# EasyEDA schematic Sheet.json
TITLE: Mini Mini Robotlar; REV: 1.0; Date: 2023-05-15; Sheet: 1/1; Drawn By: Emir Bahadir Unsal; Company: Xor ve Otesi
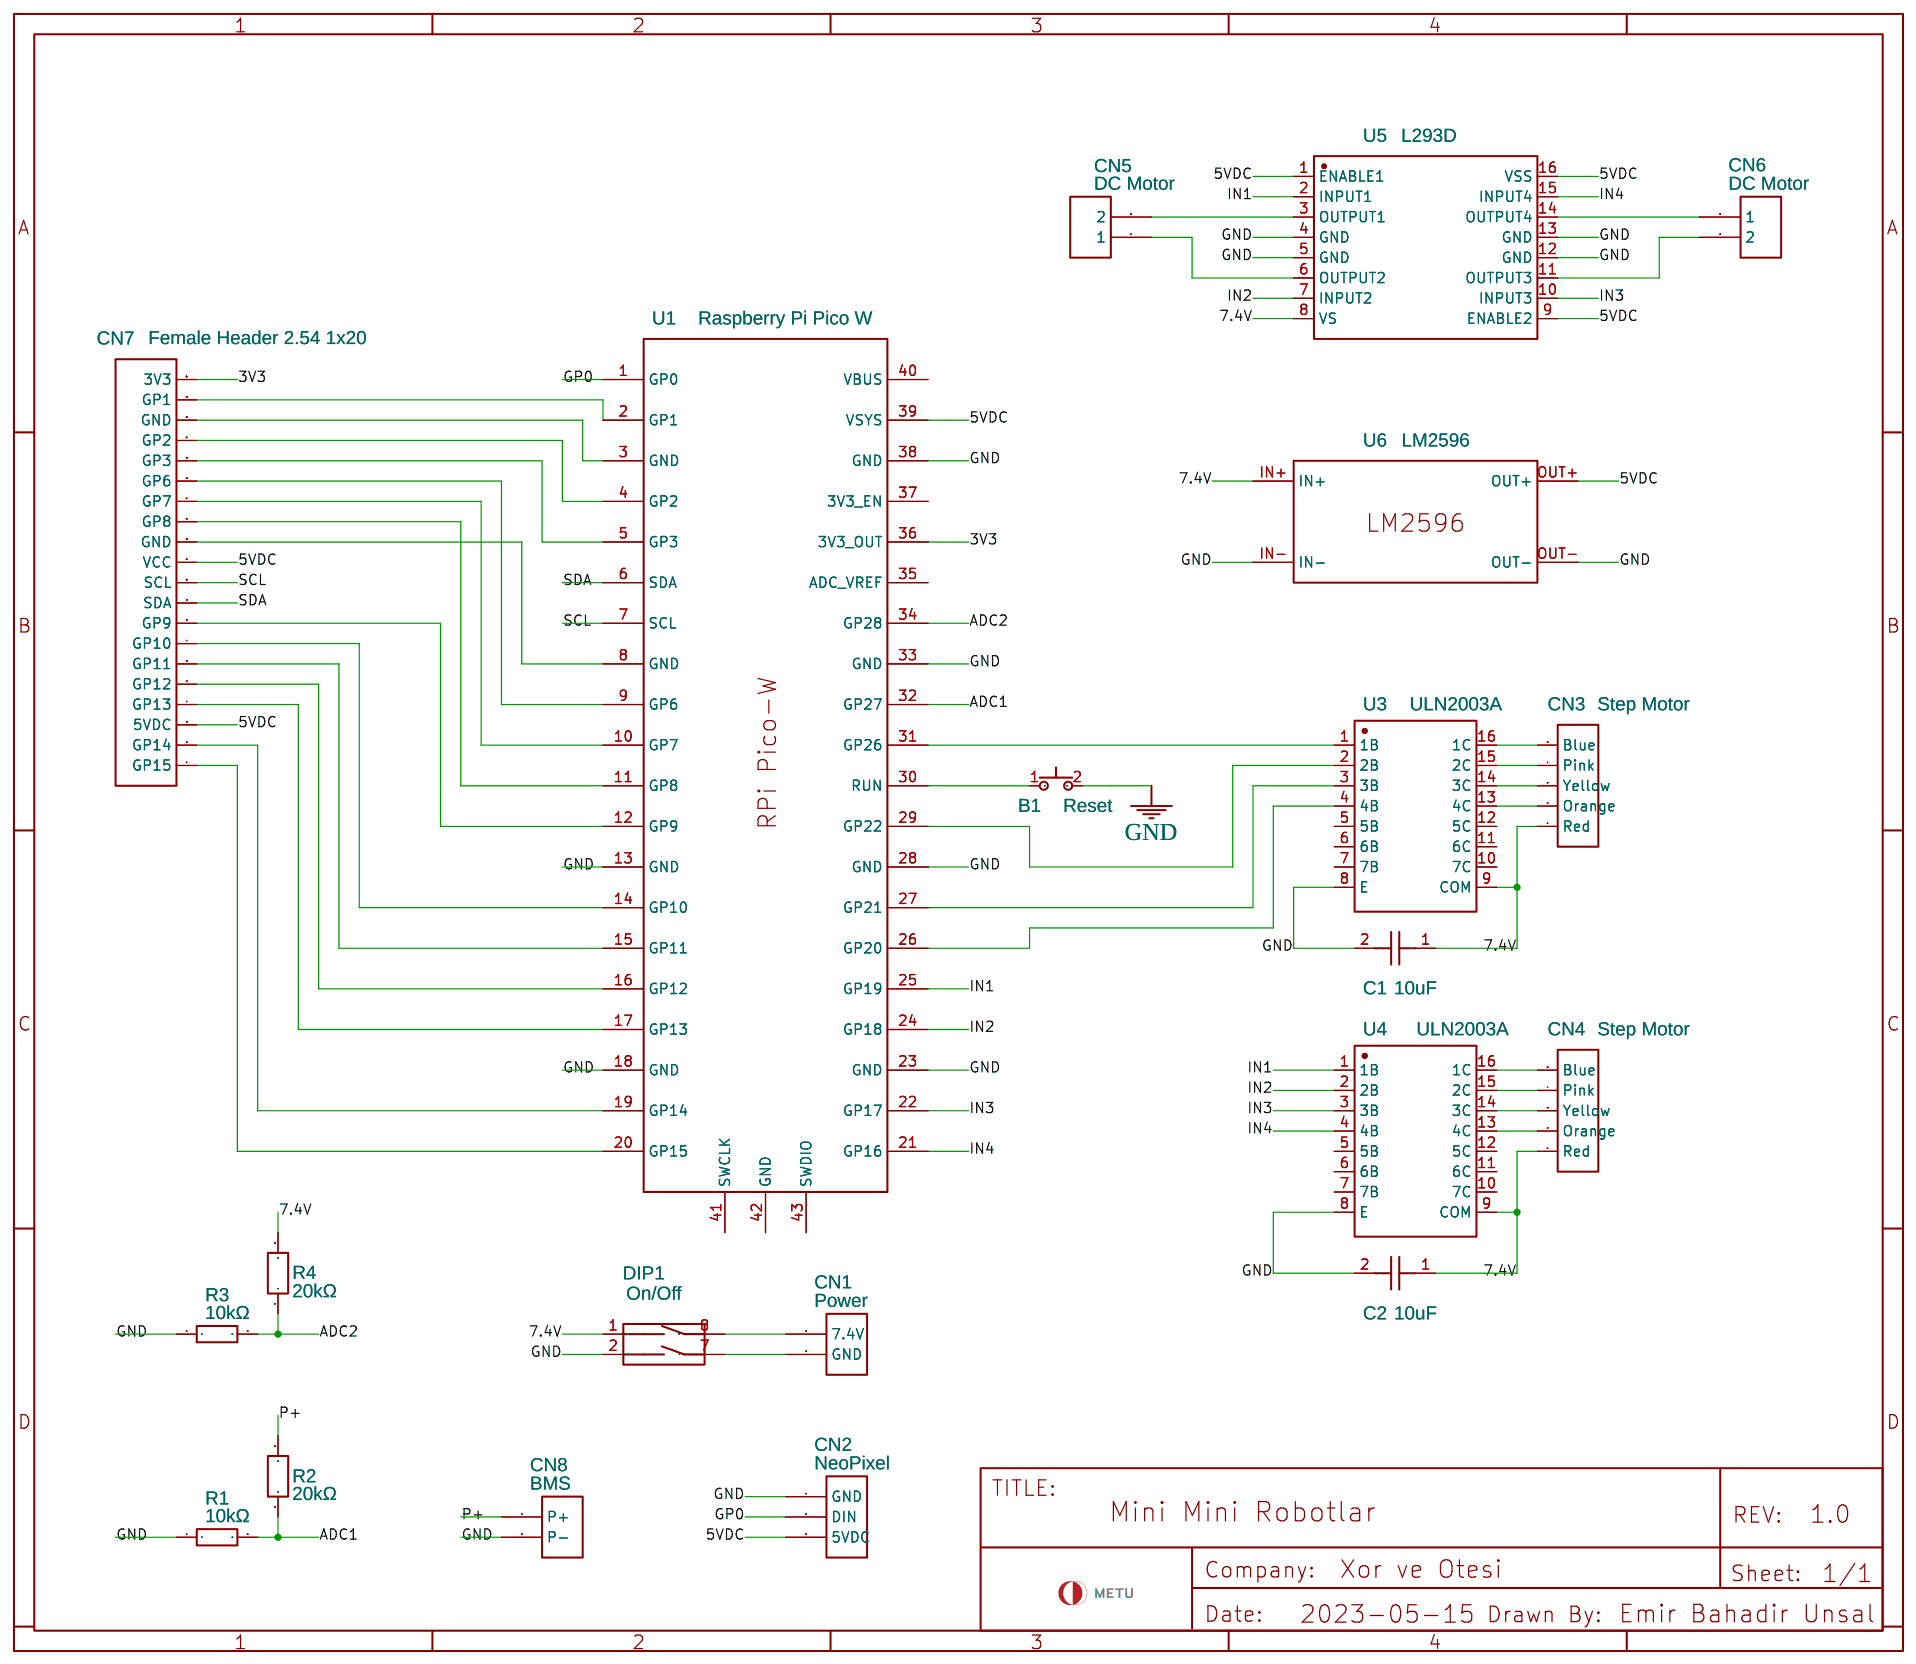
[diagram p0: schematic sheet]

## Parts
B1  Reset  [BUTTON 2PIN]
C1  10uF  [10UF_16V]
C2  10uF  [10UF_16V]
CN1  Power  [JST-XH_2P-2.54MM]
CN2  NeoPixel  [JST-XH_3_JD]
CN3  Step Motor  [JST 2.54MM 5PIN]
CN4  Step Motor  [JST 2.54MM 5PIN]
CN5  DC Motor  [JST-XH_2P-2.54MM]
CN6  DC Motor  [JST-XH_2P-2.54MM]
CN7  Female Header 2.54 1x20  [HDR-TH_20P-P2.54-V-F]
CN8  BMS  [JST-XH_2P-2.54MM]
DIP1  On/Off  [DIP SWITCH 2 SWITCHES]
R1  10kΩ  [RES-TH_BD2.3-L6.5-P10.50-D0.5]
R2  20kΩ  [RES-TH_BD2.3-L6.5-P10.50-D0.5]
R3  10kΩ  [RES-TH_BD2.3-L6.5-P10.50-D0.5]
R4  20kΩ  [RES-TH_BD2.3-L6.5-P10.50-D0.5]
U1  Raspberry Pi Pico W  [RPI PICO-W]
U3  ULN2003A  [DIP-16_L19.2-W6.6-P2.54-LS7.6-BL]
U4  ULN2003A  [DIP-16_L19.2-W6.6-P2.54-LS7.6-BL]
U5  L293D  [DIP-16_L19.2-W6.6-P2.54-LS7.6-BL]
U6  LM2596  [DC-DC-STEP-DOWN-LM2596]

## Library data of the parts
B1 = button: Supplier: addNewSupplier; Contributor: Zayden
C1 C2 = FG26X7R1E106KRT00: Supplier: LCSC; Supplier Part: C3695070; Manufacturer: TDK; Contributor: lcsc
CN1 CN5 CN6 CN8 = JST-XH_2P_2.54MM: Manufacturer Part: JST; Contributor: amun
CN2 = JST-XH_3P_2.54MM: Manufacturer Part: JST; Contributor: amun
CN3 = JST 2.54mm 5pin: Contributor: PuranSingh
CN4 = JST 2.54mm 5pin: Contributor: PuranSingh; Package Display: No
CN7 = Header-Female-2.54_1x20: Supplier: LCSC; Manufacturer: BOOMELE(博穆精密); Manufacturer Part: 2.54-1*20P母; Supplier Part: C50984; JLCPCB Part Class: Extended Part
DIP1 = DIP SWITCH 2: Supplier: RS-Online; Manufacturer: DIP; Manufacturer Part: DIP switchEI-08; Supplier Part: C90019; Contributor: michalsky; libConvert: Yes; Add into BOM: Yes
R1 R3 = RI40-1/4W-10KΩ ±5% T: Supplier: LCSC; Supplier Part: C136549; Manufacturer: CCO(千志电子); Resistance (Ohms): 10K; Contributor: LCSC; JLCPCB Part Class: Extended Part
R2 R4 = MF1/4W-20KΩ±1%T52: Supplier: LCSC; Supplier Part: C714021; Manufacturer: Huaxing Mechanical-Elec.; Contributor: LCSC; JLCPCB Part Class: Extended Part
U1 = RPi Pico-W: Manufacturer: Raspberry Pi Foundation; Manufacturer Part: Pi Pico; Supplier: Raspberry Pi; Supplier Part: Raspberry Pi Pico-W; link: https://datasheets.raspberrypi.com/picow/pico-w-datasheet.pdf; Contributor: Rovonius
U3 U4 = ULN2003APG: Supplier: LCSC; Manufacturer: TOSHIBA(东芝); Supplier Part: C5251; JLCPCB Part Class: Extended Part
U5 = L293DN: Supplier: LCSC; Supplier Part: C434590; Manufacturer: HGSEMI; Contributor: LCSC; JLCPCB Part Class: Extended Part
U6 = LM2596: Contributor: Saad_Mazumder

## Nets
3V3: CN7.20(3V3) U1.36(3V3_OUT)
5VDC: CN2.3(5VDC) CN7.3(5VDC) CN7.11(VCC) U1.39(VSYS) U5.1(ENABLE1) U5.9(ENABLE2) U5.16(VSS) U6.OUT+
7.4V: C1.1 C2.1 CN3.1(Red) CN4.1(Red) DIP1.1 R4.2 U3.9(COM) U4.9(COM) U5.8(VS) U6.IN+
GND: B1.2 C1.2 C2.2 CN2.1(GND) CN8.2(P-) DIP1.2 R1.1 R3.1 U1.13(GND) U1.18(GND) U1.23(GND) U1.28(GND) U1.33(GND) U1.38(GND) U3.8(E) U4.8(E) U5.4(GND) U5.5(GND) U5.12(GND) U5.13(GND) U6.IN- U6.OUT-
ADC1: R1.2 R2.1 U1.32(GP27)
ADC2: R3.2 R4.1 U1.34(GP28)
GP0: CN2.2(DIN) U1.1(GP0)
IN1: U1.25(GP19) U4.1(1B) U5.2(INPUT1)
IN2: U1.24(GP18) U4.2(2B) U5.7(INPUT2)
IN3: U1.22(GP17) U4.3(3B) U5.10(INPUT3)
IN4: U1.21(GP16) U4.4(4B) U5.15(INPUT4)
P+: CN8.1(P+) R2.2
SCL: CN7.10(SCL) U1.7(SCL)
SDA: CN7.9(SDA) U1.6(SDA)
Net-(B1-1): B1.1 U1.30(RUN)
Net-(CN1-1): CN1.1(7.4V) DIP1.8
Net-(CN1-2): CN1.2(GND) DIP1.7
Net-(CN3-2): CN3.2(Orange) U3.13(4C)
Net-(CN3-3): CN3.3(Yellow) U3.14(3C)
Net-(CN3-4): CN3.4(Pink) U3.15(2C)
Net-(CN3-5): CN3.5(Blue) U3.16(1C)
Net-(CN4-2): CN4.2(Orange) U4.13(4C)
Net-(CN4-3): CN4.3(Yellow) U4.14(3C)
Net-(CN4-4): CN4.4(Pink) U4.15(2C)
Net-(CN4-5): CN4.5(Blue) U4.16(1C)
Net-(CN5-1): CN5.1 U5.6(OUTPUT2)
Net-(CN5-2): CN5.2 U5.3(OUTPUT1)
Net-(CN6-1): CN6.1 U5.14(OUTPUT4)
Net-(CN6-2): CN6.2 U5.11(OUTPUT3)
Net-(CN7-1): CN7.1(GP15) U1.20(GP15)
Net-(CN7-2): CN7.2(GP14) U1.19(GP14)
Net-(CN7-4): CN7.4(GP13) U1.17(GP13)
Net-(CN7-5): CN7.5(GP12) U1.16(GP12)
Net-(CN7-6): CN7.6(GP11) U1.15(GP11)
Net-(CN7-7): CN7.7(GP10) U1.14(GP10)
Net-(CN7-8): CN7.8(GP9) U1.12(GP9)
Net-(CN7-12): CN7.12(GND) U1.8(GND)
Net-(CN7-13): CN7.13(GP8) U1.11(GP8)
Net-(CN7-14): CN7.14(GP7) U1.10(GP7)
Net-(CN7-15): CN7.15(GP6) U1.9(GP6)
Net-(CN7-16): CN7.16(GP3) U1.5(GP3)
Net-(CN7-17): CN7.17(GP2) U1.4(GP2)
Net-(CN7-18): CN7.18(GND) U1.3(GND)
Net-(CN7-19): CN7.19(GP1) U1.2(GP1)
Net-(U1-26): U1.26(GP20) U3.4(4B)
Net-(U1-27): U1.27(GP21) U3.3(3B)
Net-(U1-29): U1.29(GP22) U3.2(2B)
Net-(U1-31): U1.31(GP26) U3.1(1B)

Not connected (* = marked no-connect by the designer): U1 35(ADC_VREF) 37(3V3_EN) 40(VBUS) 41(SWCLK) 42(GND) 43(SWDIO); U3 5(5B) 6(6B) 7(7B) 10(7C) 11(6C) 12(5C); U4 5(5B) 6(6B) 7(7B) 10(7C) 11(6C) 12(5C)
